# EAGLE design ledterne_display (EAGLE 7.3.0)
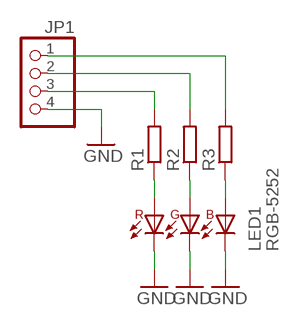
[diagram p0: schematic, sheet 1]

## Parts
JP1  PINHD-1X4  [1X04]
LED1  RGB-5252  [SMD_5252]
R1  R-EU_R0805  [R0805]
R2  R-EU_R0805  [R0805]
R3  R-EU_R0805  [R0805]

## Nets
GND: JP1.4 LED1.P4(CGREEN) LED1.P5(CRED) LED1.P6(CBLUE)
LED_B: JP1.1 R3.2
LED_G: JP1.2 R2.2
LED_R: JP1.3 R1.2
N$1: LED1.P2(ARED) R1.1
N$2: LED1.P3(AGREEN) R2.1
N$3: LED1.P1(ABLUE) R3.1

## Library data of the parts
JP1 = pinhead:PINHD-1X4: PIN HEADER
LED1 = led-rgb:RGB-5252
R1-R3 = resistor:R-EU_: RESISTOR, European symbol

## Board
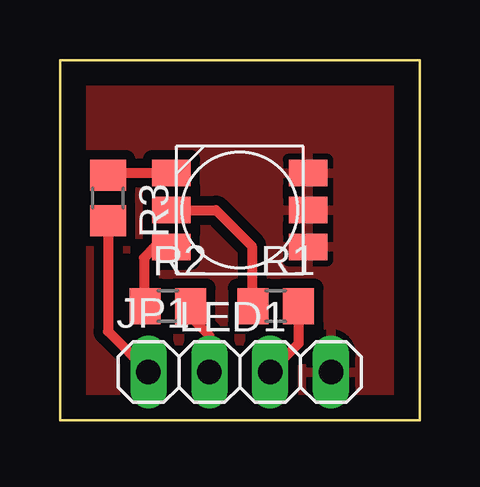
[diagram p1: board, top side]

Size 15 x 15 mm. Coordinates in mm from the lower left corner, seen from the top.
Outline: 0,0 15,0 15,15 0,15 0,0
Copper layers (1*16): Top 0.035mm / dielectric 1.5mm / Bottom 0.035mm
Design rules "default": minimum track width 10mil, minimum drill 24mil, track to track 8mil, track to pad 8mil, pad to pad 8mil, via to via 8mil, smd to smd 8mil, copper to edge 40mil, drill to drill 8mil, minimum pad ring 10mil, minimum via ring 8mil, stop-mask expansion 4mil, vias tented up to drill 0mil, thermal gap 10mil

### Footprints (pad centres in the part's own frame; a part is rotated, then mirrored left to right if it is on the bottom)
1X04 = drill 1.016 long: 1 -3.81,0; 2 -1.27,0; 3 1.27,0; 4 3.81,0
SMD_5252 = smd 1.6 x 1.116: P1 -2.85,1.54; P2 -2.85,0; P3 -2.85,-1.54; P4 2.85,-1.54; P5 2.85,0; P6 2.85,1.54
R0805 = smd 1.3 x 1.5: 1 -0.95,0; 2 0.95,0

### Placement (x,y rotation side)
JP1  7.5,2 0 top
LED1  7.5,8.75 0 top
R1  9,4.75 0 top
R2  4.5,4.75 0 top
R3  2,9.25 270 top

### Tracks (layer width: path | path; a pad name or v marks a point on that pad's centre or on a via)
GND
  pour Top (isolate 0.4): 0.5,0.5 14.5,0.5 14.5,14.5 0.5,14.5
LED_B
  Top 0.406: R3.2 2,3.69 JP1.1
LED_G
  Top 0.406: JP1.2 6.23,3.52 5.5,4.25 5.5,4.7 R2.2
LED_R
  Top 0.406: R1.2 9.95,3.18 JP1.3
N$1
  Top 0.406: LED1.P2 6.5,8.75 8,7.25 8,4.8 R1.1
N$2
  Top 0.406: LED1.P3 3.96,7.21 3.5,6.75 3.5,4.8 R2.1
N$3
  Top 0.406: LED1.P1 2.09,10.29 R3.1